# EAGLE design C-Track_V2_R1 (EAGLE 9.6.2)
ABTEILUNG: Technische Informatik; BEARBEITER: Samuel Putz; DOKUMENTART: Schaltplan; GEZ: PutS; ID: 5BHEL; REV: 1; STATUS: Prototyp; VER: 1.0
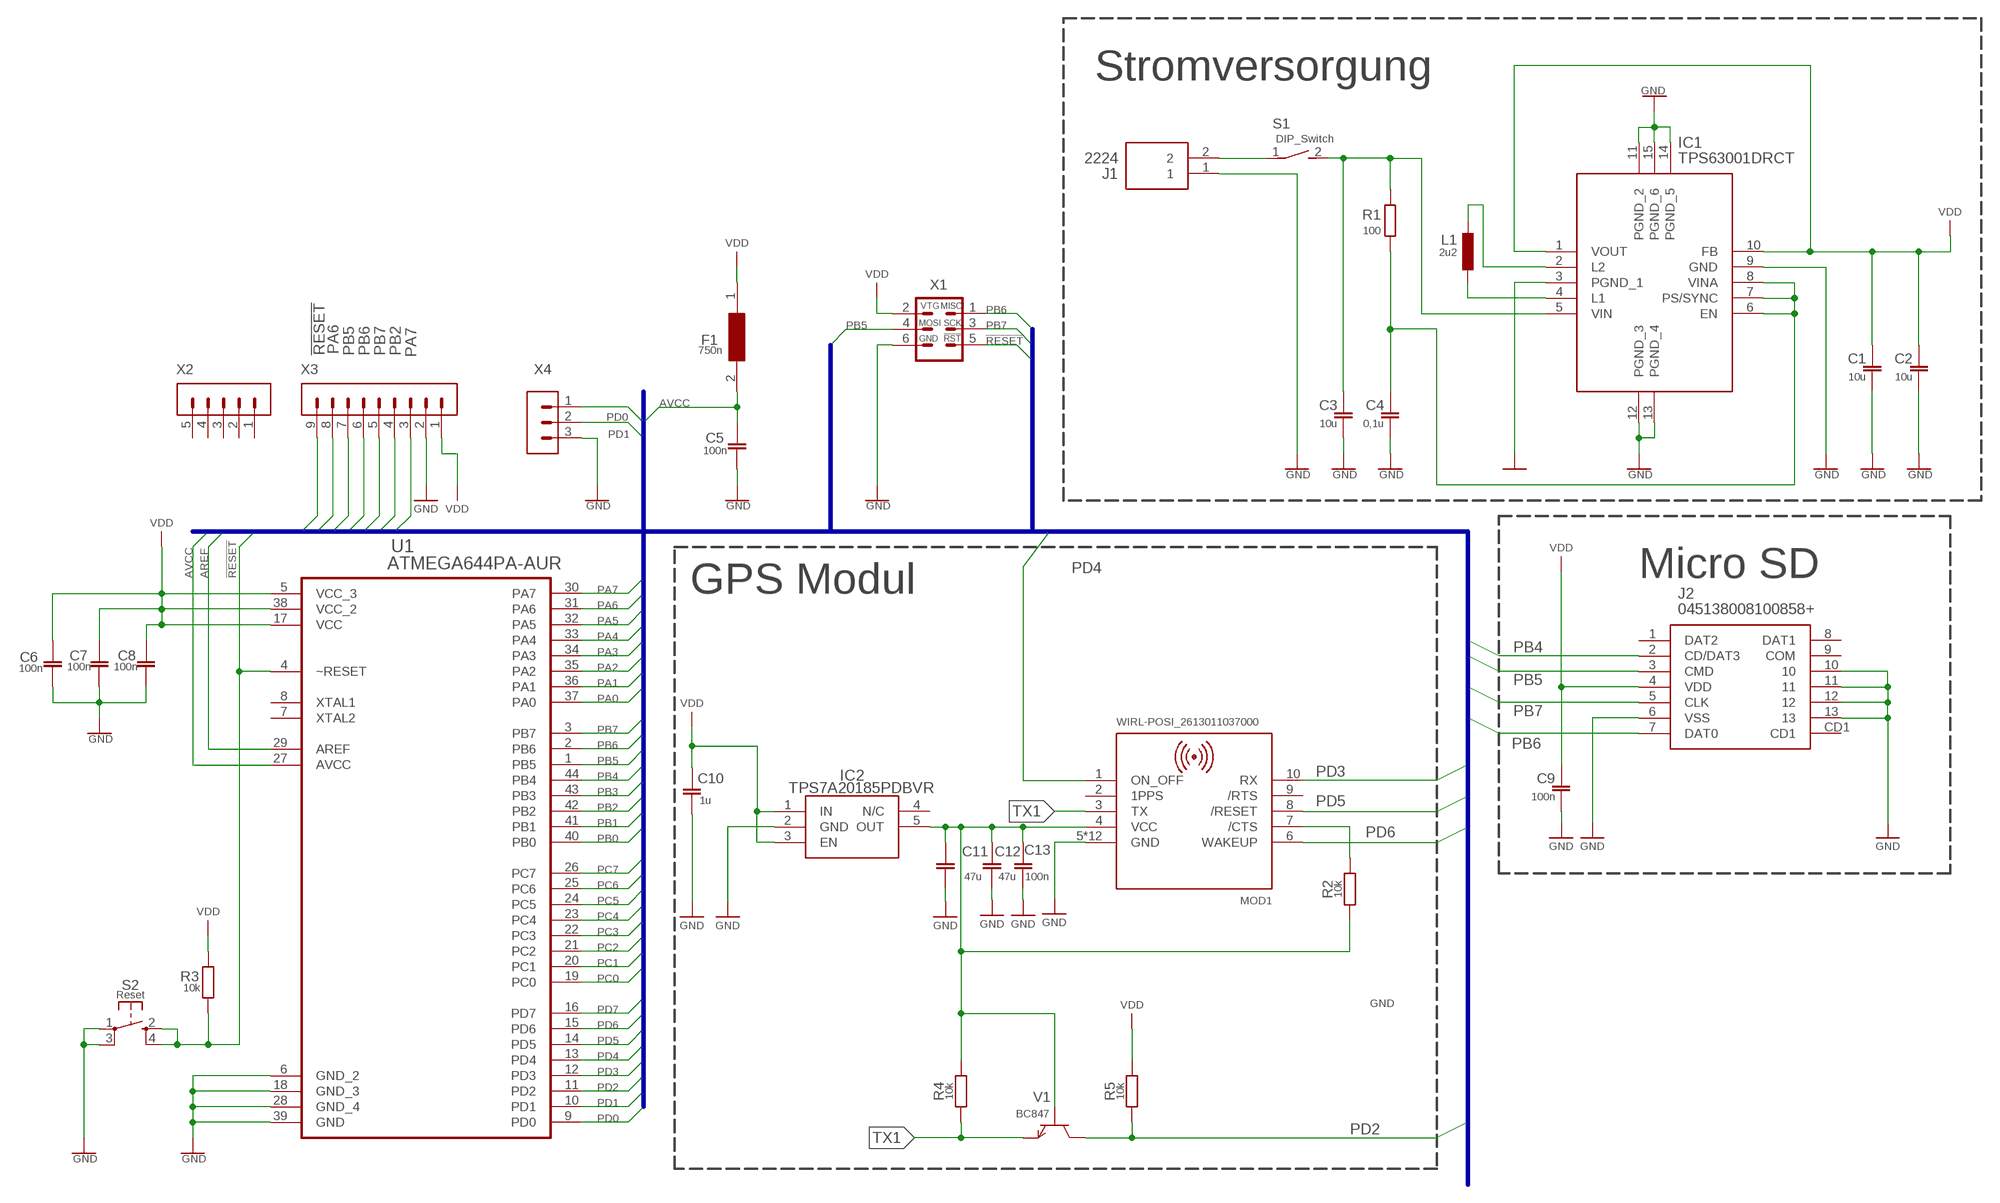
[diagram p0: schematic, sheet 1]

## Parts
C1  10u  C-EUC0805  [C0805]
C2  10u  C-EUC0805  [C0805]
C3  10u  C-EUC0805  [C0805]
C4  0,1u  C-EUC0805  [C0805]
C5  100n  C-EUC0805  [C0805]
C6  100n  C-EUC0805  [C0805]
C7  100n  C-EUC0805  [C0805]
C8  100n  C-EUC0805  [C0805]
C9  100n  C-EUC0805  [C0805]
C10  1u  C-EUC0805  [C0805]
C11  47u  C-EUC0805  [C0805]
C12  47u  C-EUC0805  [C0805]
C13  100n  C-EUC0805  [C0805]
F1  750n  SF-1206HH1200R-2  [SF1206HH1200R2]
IC1  TPS63001DRCT  [TPS63001DRCT]
IC2  TPS7A20185PDBVR  [SOT95P280X145-5N]
J1  2224  [2224]
J2  045138008100858+  [045138008100858]
L1  2u2  L-EU0805  [L0805]
MOD1  WIRL-POSI_2613011037000  [WIRL-POSI_2613011037000]
R1  100  R-EU_M0805  [M0805]
R2  10k  R-EU_M0805  [M0805]
R3  10k  R-EU_M0805  [M0805]
R4  10k  R-EU_M0805  [M0805]
R5  10k  R-EU_M0805  [M0805]
S1  DIP_Switch  DS04-254-2-01BK-SMT  [DS04254201BKSMT]
S2  Reset  TASTE10-XXWE_TASV_MICRO  [WS-TASV-MICRO]
U1  ATMEGA644PA-AUR  [QFP80P1200X1200X120-44N]
V1  BC847  [SOT23]
X1  MA03-2-  [MA03-2-]
X2  MA05-1  [MA05-1]
X3  MA09-1MA-09-1  [MA09-1]
X4  MA03-1  [MA03-1]

## Nets
!RESET: R3.1 S2.2(S) S2.4(S1) U1.4(~RESET) X1.5 X3.9
AREF: U1.29(AREF)
AVCC: C5.1 F1.2 U1.27(AVCC)
GND: C1.2 C2.2 C3.2 C4.2 C5.2 C6.2 C7.2 C8.2 C9.2 C10.2 C11.2 C12.2 C13.2 IC1.3(PGND_1) IC1.9(GND) IC1.11(PGND_2) IC1.12(PGND_3) IC1.13(PGND_4) IC1.14(PGND_5) IC1.15(PGND_6) IC2.2(GND) J1.1 J2.6(VSS) J2.10 J2.11 J2.12 J2.13 MOD1.5(GND) MOD1.P$1(GND) MOD1.P$2(GND) MOD1.P$3(GND) MOD1.P$4(GND) MOD1.P$5(GND) MOD1.P$6(GND) MOD1.P$7(GND) MOD1.P$8(GND) MOD1.P$9(GND) MOD1.P$10(GND) MOD1.P$11(GND) S2.1(P) S2.3(P1) U1.6(GND_2) U1.18(GND_3) U1.28(GND_4) U1.39(GND) X1.6 X3.2 X4.3
N$2: C3.1 IC1.5(VIN) R1.2 S1.2
N$3: IC1.4(L1) L1.1
N$4: C4.1 IC1.6(EN) IC1.7(PS/SYNC) IC1.8(VINA) R1.1
N$5: IC1.2(L2) L1.2
N$6: J1.2 S1.1
N$7: C11.1 C12.1 C13.1 IC2.5(OUT) MOD1.4(VCC) R2.1 R4.2 V1.1(B)
N$11: MOD1.7(/CTS) R2.2
PA0: U1.37(PA0)
PA1: U1.36(PA1)
PA2: U1.35(PA2)
PA3: U1.34(PA3)
PA4: U1.33(PA4)
PA5: U1.32(PA5)
PA6: U1.31(PA6) X3.8
PA7: U1.30(PA7) X3.3
PB0: U1.40(PB0)
PB1: U1.41(PB1)
PB2: U1.42(PB2) X3.4
PB3: U1.43(PB3)
PB4: J2.2(CD/DAT3) U1.44(PB4)
PB5: J2.3(CMD) U1.1(PB5) X1.4 X3.7
PB6: J2.7(DAT0) U1.2(PB6) X1.1 X3.6
PB7: J2.5(CLK) U1.3(PB7) X1.3 X3.5
PC0: U1.19(PC0)
PC1: U1.20(PC1)
PC2: U1.21(PC2)
PC3: U1.22(PC3)
PC4: U1.23(PC4)
PC5: U1.24(PC5)
PC6: U1.25(PC6)
PC7: U1.26(PC7)
PD0: U1.9(PD0) X4.1
PD1: U1.10(PD1) X4.2
PD2: R5.1 U1.11(PD2) V1.3(C)
PD3: MOD1.10(RX) U1.12(PD3)
PD4: MOD1.1(ON_OFF) U1.13(PD4)
PD5: MOD1.8(/RESET) U1.14(PD5)
PD6: MOD1.6(WAKEUP) U1.15(PD6)
PD7: U1.16(PD7)
TX1: MOD1.3(TX) R4.1 V1.2(E)
VDD: C1.1 C2.1 C6.1 C7.1 C8.1 C9.1 C10.1 F1.1 IC1.1(VOUT) IC1.10(FB) IC2.1(IN) IC2.3(EN) J2.4(VDD) R3.2 R5.2 U1.5(VCC_3) U1.17(VCC) U1.38(VCC_2) X1.2 X3.1
Unconnected: IC2.4(N/C) J2.1(DAT2) J2.8(DAT1) J2.9(COM) J2.CD1 MOD1.2(1PPS) MOD1.9(/RTS) U1.7(XTAL2) U1.8(XTAL1) X2.1 X2.2 X2.3 X2.4 X2.5

## Buses
AREF,AVCC,PA[0..7],PB[0..7],PC[0..7],PD[0..7],!RESET,VDD,XTAL2

## Notes on the sheet
- Stromversorgung
- VTG | MISO
- MOSI | SCK
- GND | !RST
- Micro SD
- GPS Modul

## Library data of the parts
C1-C13 = rcl_PutS:C-EU: CAPACITOR, European symbol
F1 = SF-1206HH1200R-2:SF-1206HH1200R-2: 1206 high-current met-foil. 12A Source: Datasheet <https://www.bourns.com/docs/Product-Datasheets/SF-1206HH-R.pdf>; DESCRIPTION: 1206 high-current met-foil. 12A; HEIGHT: 1.2mm; MANUFACTURER_NAME: Bourns; MANUFACTURER_PART_NUMBER: SF-1206HH1200R-2; MOUSER_PART_NUMBER: 652-SF-1206HH1200R-2; MOUSER_PRICE-STOCK: https://www.mouser.co.uk/ProductDetail/Bourns/SF-1206HH1200R-2?qs=Imq1NPwxi77cMrTLAtpSCg%3D%3D
IC1 = ic_PutS:TPS63001DRCT: Conv DC-DC Single-OUT Non-Inv/Step Source: Datasheet <https://www.ti.com/lit/gpn/TPS63001>; DESCRIPTION: Conv DC-DC Single-OUT Non-Inv/Step; HEIGHT: 1mm; MANUFACTURER_NAME: Texas Instruments; MANUFACTURER_PART_NUMBER: TPS63001DRCT; MOUSER_PART_NUMBER: 595-TPS63001DRCT; MOUSER_PRICE-STOCK: https://www.mouser.co.uk/ProductDetail/Texas-Instruments/TPS63001DRCT?qs=7kv20MEVUlgqNQNnGuTeFA%3D%3D
IC2 = SamacSys_Parts:TPS7A20185PDBVR: LDO Voltage Regulators 300-mA, ultra-low-noise, low-IQ, low-dropout (LDO) linear regulator with high PSRR 5-SOT-23 -40 to 125 Source: Datasheet <https://www.ti.com/lit/ds/symlink/tps7a20.pdf?ts=1627743306325&ref_url=https%3A%2F%2Fwww.ti.com%2Fproduct%2FTPS7A20>; DESCRIPTION: LDO Voltage Regulators 300-mA, ultra-low-noise, low-IQ, low-dropout (LDO) linear regulator with high PSRR 5-SOT-23 -40 to 125; HEIGHT: 1.45mm; MANUFACTURER_NAME: Texas Instruments; MANUFACTURER_PART_NUMBER: TPS7A20185PDBVR; MOUSER_PART_NUMBER: 595-TPS7A20185PDBVR; MOUSER_PRICE-STOCK: https://www.mouser.co.uk/ProductDetail/Texas-Instruments/TPS7A20185PDBVR?qs=hd1VzrDQEGgQiYm%252BUIe6ow%3D%3D
J1 = battery_PutS:2224: Cylindrical Battery Contacts, Clips, Holders & Springs C CELL ALUM HOLDER Source: Datasheet; DESCRIPTION: Cylindrical Battery Contacts, Clips, Holders & Springs C CELL ALUM HOLDER; HEIGHT: 20.32mm; MANUFACTURER_NAME: Keystone Electronics; MANUFACTURER_PART_NUMBER: 2224; MOUSER_PART_NUMBER: 534-2224; MOUSER_PRICE-STOCK: https://www.mouser.co.uk/ProductDetail/Keystone-Electronics/2224?qs=l8Mz4RVwyfn6c0GV6Hw2pQ%3D%3D
J2 = con_PutS:045138008100858+: Memory Card Connectors MICRO SD CARD 5138 SERIES Source: Datasheet <https://www.mouser.sg/datasheet/2/909/5138-1359342.pdf>; DESCRIPTION: Memory Card Connectors MICRO SD CARD 5138 SERIES; HEIGHT: 1.4mm; MANUFACTURER_NAME: AVX; MANUFACTURER_PART_NUMBER: 045138008100858+; MOUSER_PART_NUMBER: 581-045138008100858+; MOUSER_PRICE-STOCK: https://www.mouser.com/Search/Refine.aspx?Keyword=581-045138008100858%2B
L1 = rcl_PutS:L-EU: INDUCTOR, European symbol
MOD1 = WE_WIRL_Rev10:WIRL-POSI_2613011037000: Elara-I GNSS Module - GPS and GLONASS. WIRL-POSI GNSS Module - Integrated patch antenna Details see: https://we-online.de/katalog/en/article/2613011037000/; HEIGHT: 5.9mm; MANUFACTURER: Würth Elektronik; NR: 2613011037000
R1-R5 = rcl_PutS:R-EU_: RESISTOR, European symbol
S1 = switch_PutS:DS04-254-2-01BK-SMT: DIP Switches / SIP Switches DIP Switch, SPST, 2.54 pitch, flat actuator, SMT, 1 position, Black Source: Datasheet <https://datasheet.datasheetarchive.com/originals/distributors/Datasheets_SAMA/c6ff744c627a82ac82db8ce1595a468c.pdf>; DESCRIPTION: DIP Switches / SIP Switches DIP Switch, SPST, 2.54 pitch, flat actuator, SMT, 1 position, Black; HEIGHT: 4.85mm; MANUFACTURER_NAME: CUI Devices; MANUFACTURER_PART_NUMBER: DS04-254-2-01BK-SMT; MOUSER_PART_NUMBER: 490-DS04254201BK-SMT; MOUSER_PRICE-STOCK: https://www.mouser.co.uk/ProductDetail/CUI-Devices/DS04-254-2-01BK-SMT?qs=wnTfsH77Xs7VDGZ8jaePmA%3D%3D
S2 = switch_PoeR:TASTE10-XX: OMRON SWITCH
U1 = ic_PutS:ATMEGA644PA-AUR: 8-bit Microcontroller Microcontroller In-System Programmable Flash Check availability <https://pricing.snapeda.com/parts/ATMEGA644PA-AUR/Microchip/view-part?ref=eda>; AVAILABILITY: In Stock; CHECK_PRICES: https://www.snapeda.com/parts/ATMEGA644PA-AUR/Microchip/view-part/?ref=eda; DESCRIPTION: AVR AVR® ATmega Microcontroller IC 8-Bit 20MHz 64KB (32K x 16) FLASH 44-TQFP (10x10); MF: Microchip; MP: ATMEGA644PA-AUR; PACKAGE: TQFP-44 Atmel; PRICE: None; PURCHASE-URL: https://www.snapeda.com/api/url_track_click_mouser/?unipart_id=501858&manufacturer=Microchip&part_name=ATMEGA644PA-AUR&search_term=None; SNAPEDA_LINK: https://www.snapeda.com/parts/ATMEGA644PA-AUR/Microchip/view-part/?ref=snap
V1 = transistor_PoeF:BC84*: NPN Transistor SOT23-BEC, EN-60617 Mod. WenN / 2019 NPN Transistor: Marking of available current gain groups (Stempelung der lieferbaren Stromverstärkungsgruppen) BC846A = 1A BC846B = 1B BC847A = 1E BC847B = 1F BC847C = 1G BC850B = 1F BC850C = 1G BC848A = 1E BC848B = 1F BC848C = 1G BC849B = 1F BC849C = 1G
X1 = con_PoeR:MA03-2: PIN HEADER
X2 = con_PutS:MA05-1: PIN HEADER
X3 = con_PutS:MA09-1: PIN HEADER
X4 = con_PutS:MA03-1: PIN HEADER; OC_FARNELL: unknown; OC_NEWARK: unknown

## Board
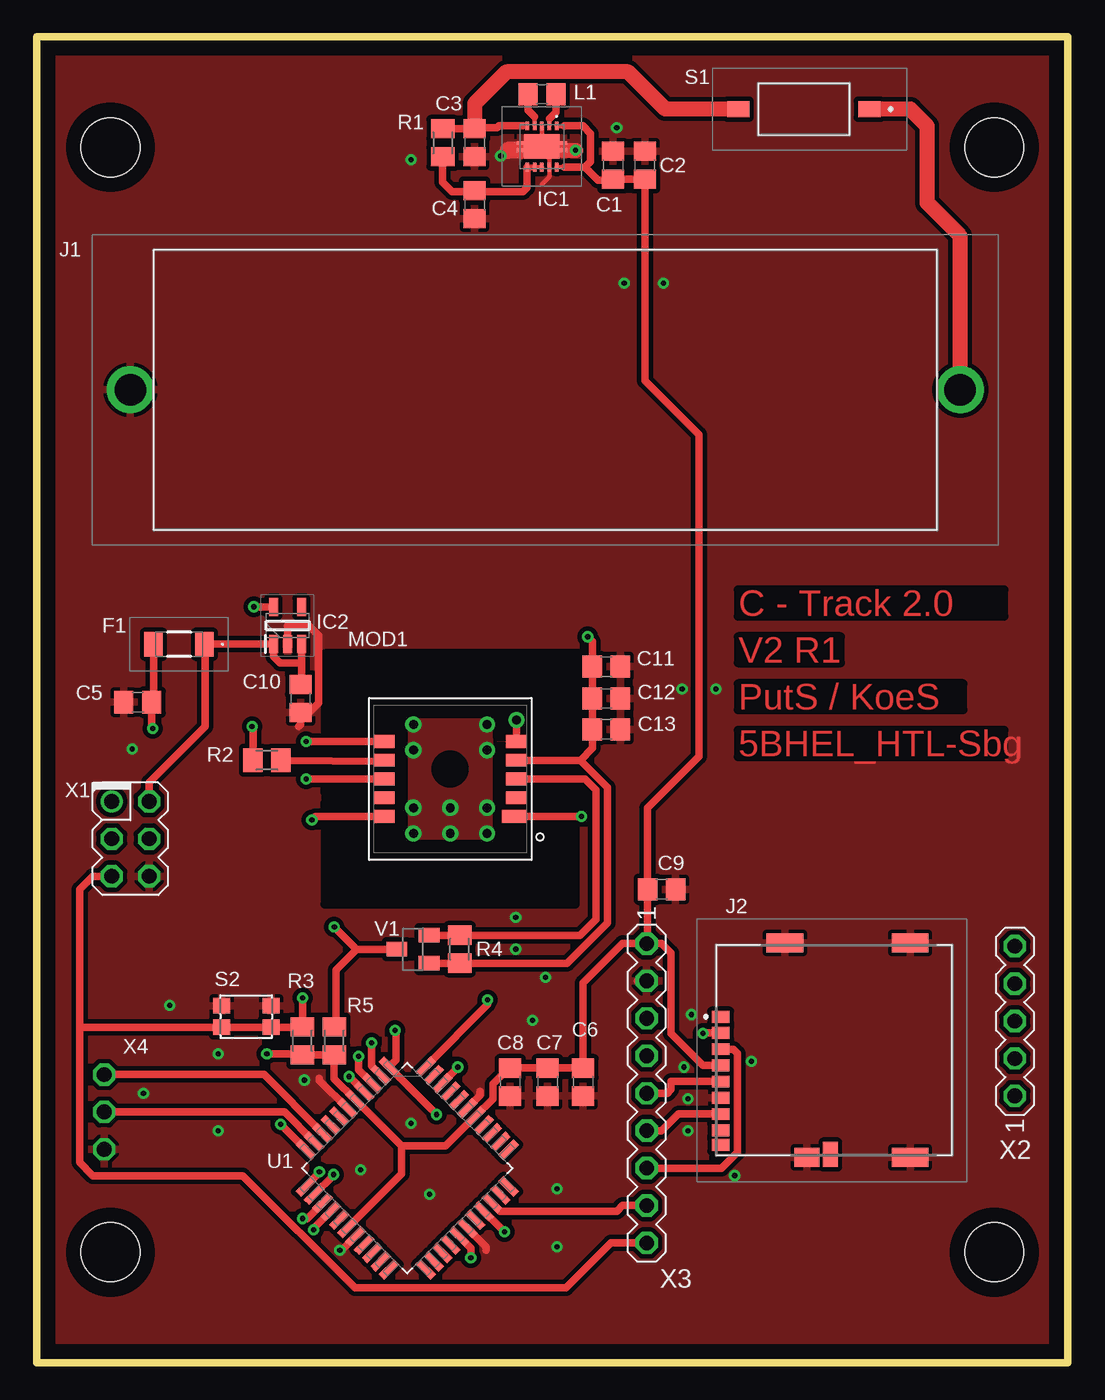
[diagram p1: board, top side]
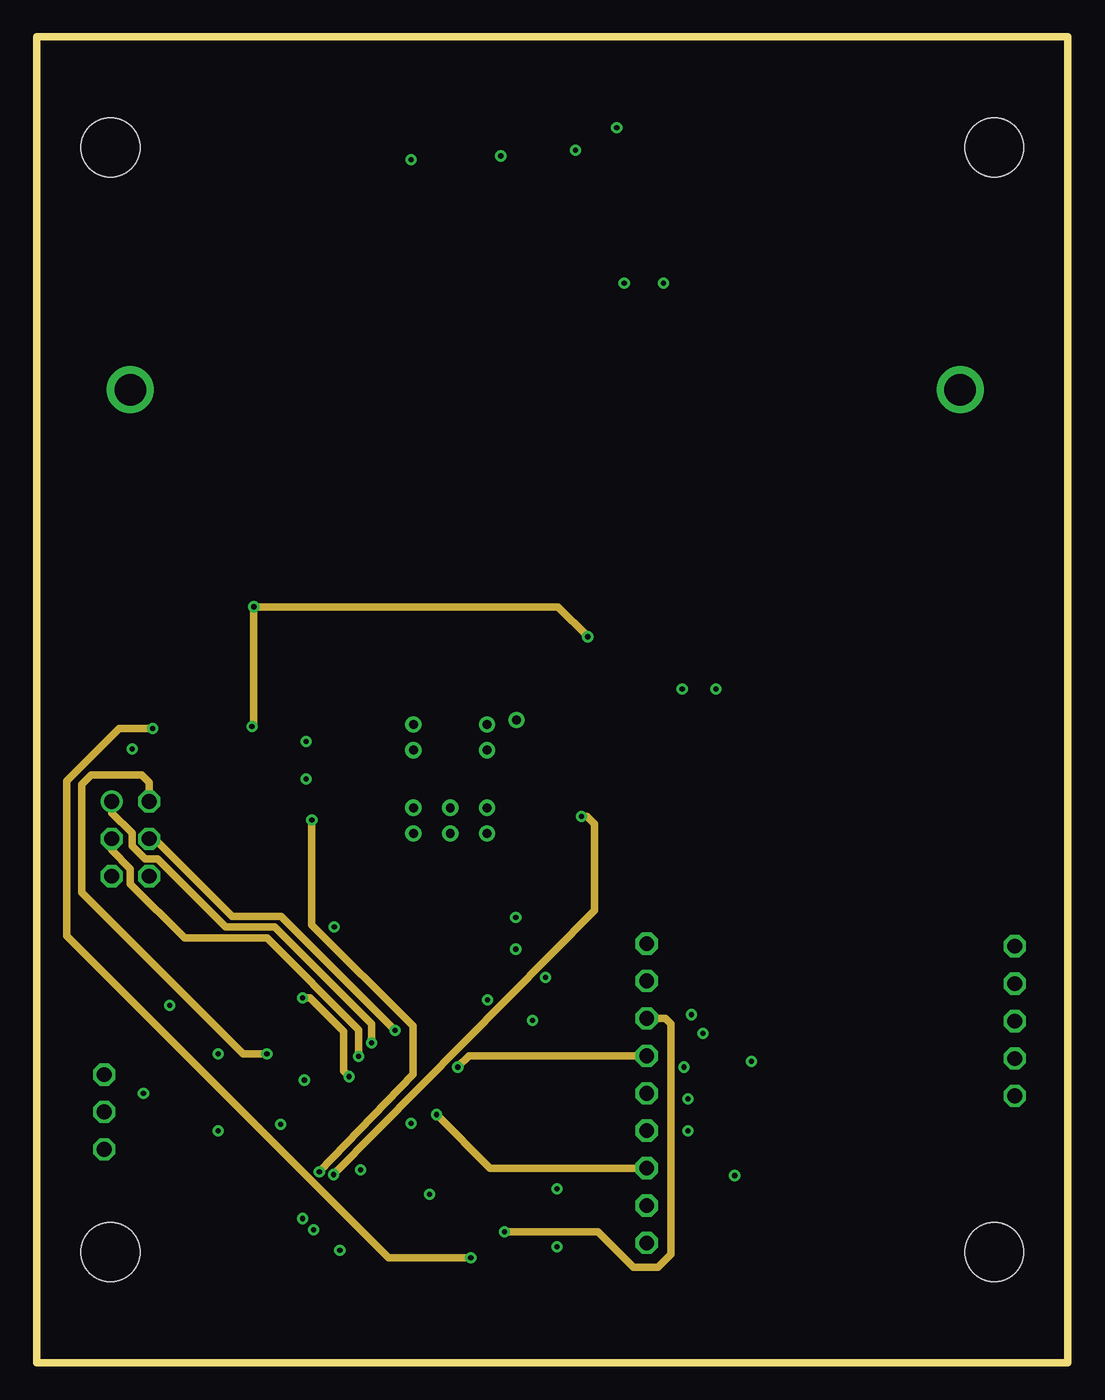
[diagram p2: board, inner layer Route2]
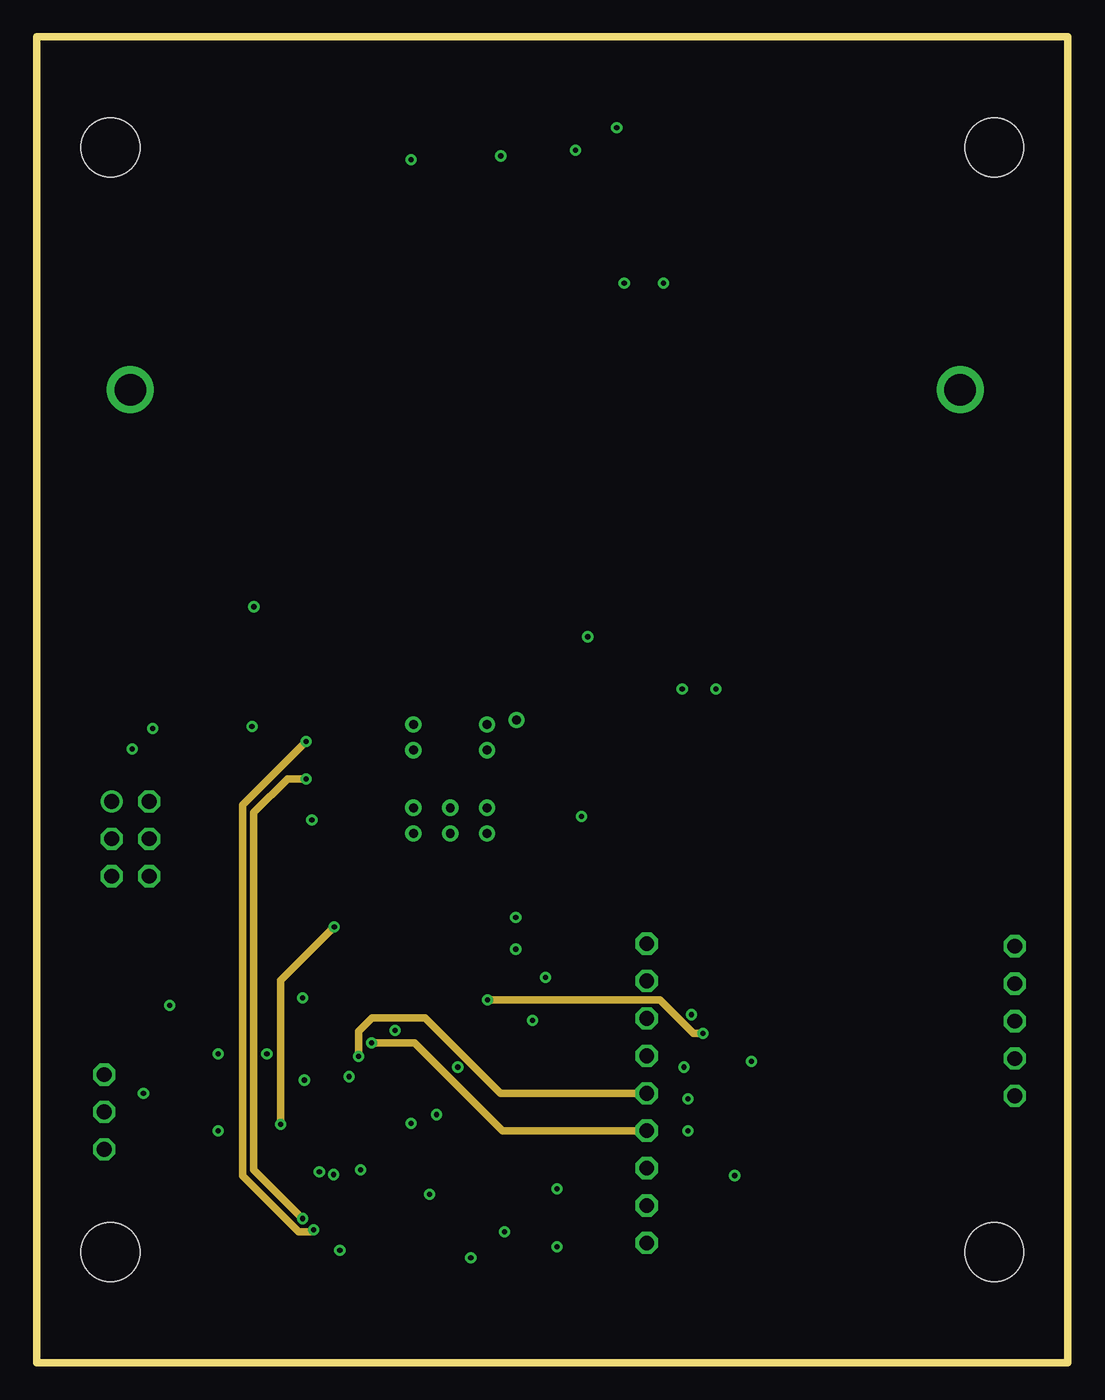
[diagram p3: board, inner layer Route15]
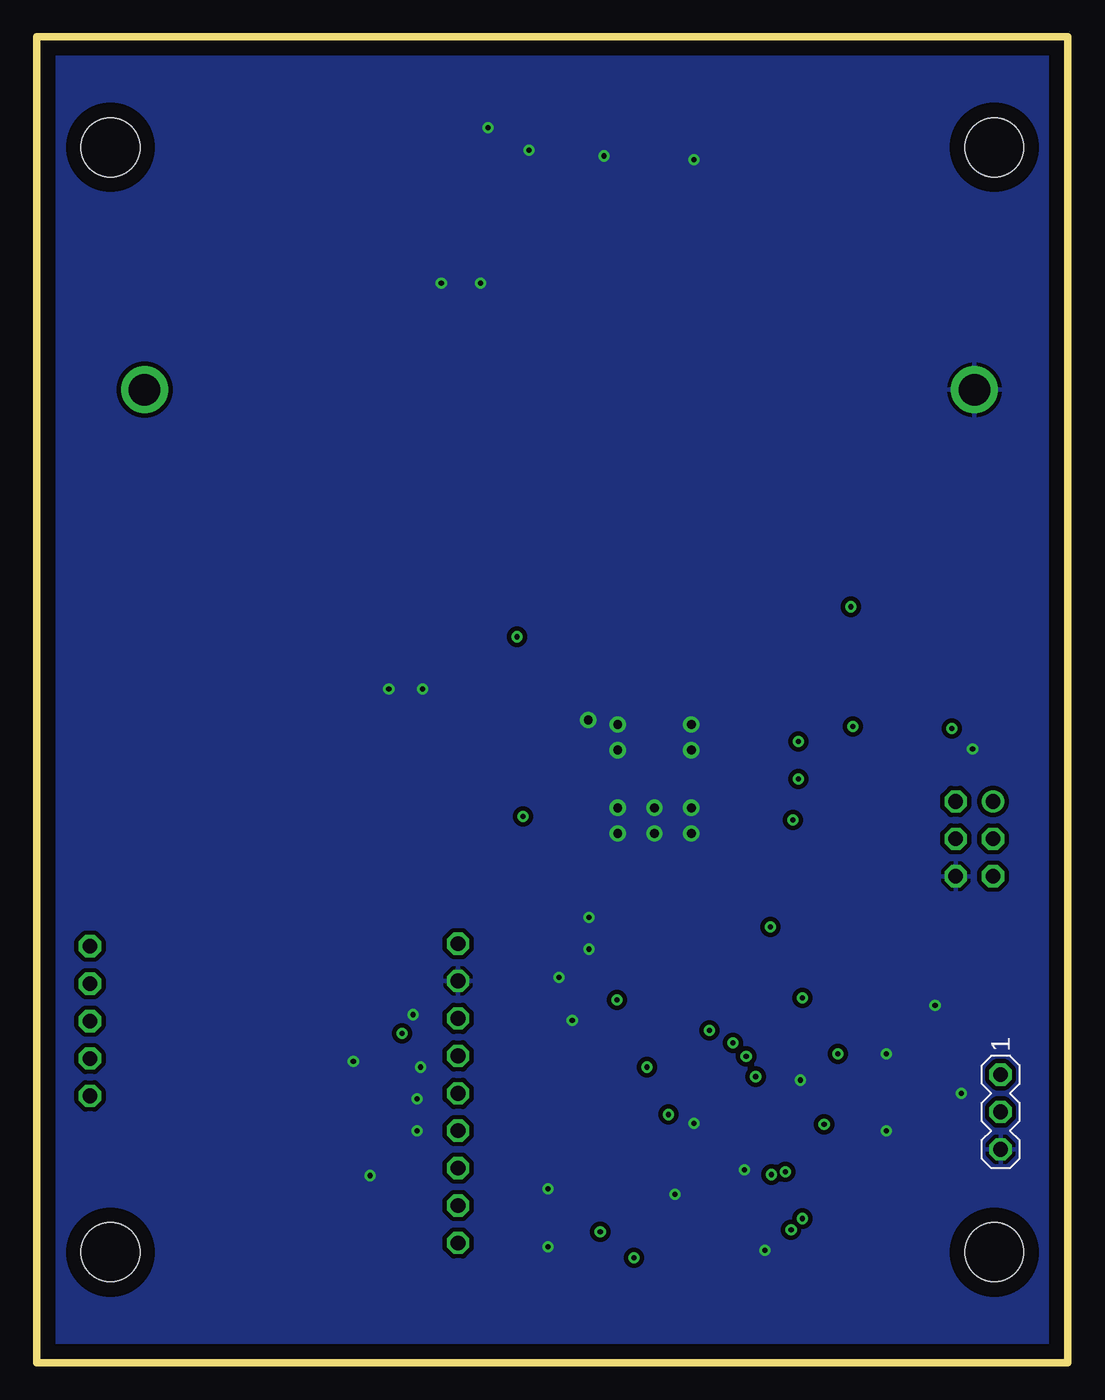
[diagram p4: board, bottom side, seen from below]

Size 70 x 90 mm. Coordinates in mm from the lower left corner, seen from the top.
Outline: 0,0 70,0 70,90 0,90 0,0
Copper layers (1+2*15+16): Top 0.035mm / dielectric 0.15mm / Route2 0.035mm / dielectric 0.15mm / Route15 0.035mm / dielectric 0.2mm / Bottom 0.035mm
Design rules "default *": minimum track width 6mil, minimum drill 0.35mm, track to track 6mil, track to pad 6mil, pad to pad 6mil, via to via 6mil, smd to smd 6mil, copper to edge 40mil, drill to drill 6mil, minimum pad ring 10mil, minimum via ring 8mil, stop-mask expansion 4mil, vias tented up to drill 0mil, thermal gap 10mil
Holes 4 mm at 5,82.5 65,82.5 65,7.5 5,7.5

### Footprints (pad centres in the part's own frame; a part is rotated, then mirrored left to right if it is on the bottom)
C0805 = smd 1.3 x 1.5: 1 -0.95,0; 2 0.95,0
SF1206HH1200R2 = smd 1.25 x 1.65: 1 -1.725,0; 2 1.725,0
TPS63001DRCT = smd 0.6 x 0.24: 1 -1.4,1; 2 -1.4,0.5; 3 -1.4,0; 4 -1.4,-0.5; 5 -1.4,-1; 6 1.4,-1; 7 1.4,-0.5; 8 1.4,0; 9 1.4,0.5; 10 1.4,1 | smd 1.65 x 2.4: 11 0,0 | smd 0.25 x 0.5: 12 -0.25,-1.45; 13 0.25,-1.45; 14 0.25,1.45; 15 -0.25,1.45
SOT95P280X145-5N = smd 1.2 x 0.6: 1 -1.25,0.95; 2 -1.25,0; 3 -1.25,-0.95; 4 1.25,-0.95; 5 1.25,0.95
2224 = drill 2.13 pad 3.195: 1 0,0; 2 56.34,0
045138008100858 = smd 0.8 x 1.2: 1 -2.27,-7.55; 2 -1.17,-7.55; 3 -0.07,-7.55; 4 1.03,-7.55; 5 2.13,-7.55; 6 3.23,-7.55; 7 4.33,-7.55; 8 5.43,-7.55; 9 6.43,-7.55 | smd 1.3 x 2.5: 10 -7.28,-3.19; 11 -7.28,5.31; 12 7.28,5.31 | smd 1.3 x 1.7: 13 7.28,-1.7 | smd 1.7 x 1: CD1 7.08,-0.1
L0805 = smd 1.3 x 1.5: 1 -0.95,0; 2 0.95,0
WIRL-POSI_2613011037000 = smd 1.676 x 0.864: 1 4.362,-2.54 | smd 1.422 x 0.864: 2 4.489,-1.27; 3 4.489,0; 4 4.489,1.27; 5 4.489,2.54; 6 -4.489,2.54; 7 -4.489,1.27; 8 -4.489,0; 9 -4.489,-1.27; 10 -4.489,-2.54 | drill 0.6: P$1 0,-3.7; P$2 -2.5,-3.7; P$3 2.5,-3.7; P$4 2.5,3.7; P$5 -2.5,3.7; P$6 -2.5,-1.96; P$7 -2.5,1.96; P$8 2.5,1.96; P$9 2.5,-1.96; P$10 0,-1.96; P$11 4.5,4
M0805 = smd 1.3 x 1.6: 1 -0.95,0; 2 0.95,0
DS04254201BKSMT = smd 1.1 x 1.5: 1 0,-4.45; 2 0,4.45
WS-TASV-MICRO = smd 1.15 x 1.05: 1 -1.675,0.725; 2 -1.675,-0.725; 3 1.675,0.725; 4 1.675,-0.725
QFP80P1200X1200X120-44N = smd 1.473 x 0.508: 1 -5.74,3.988; 2 -5.74,3.2; 3 -5.74,2.388; 4 -5.74,1.6; 5 -5.74,0.787; 6 -5.74,0; 7 -5.74,-0.787; 8 -5.74,-1.6; 9 -5.74,-2.388; 10 -5.74,-3.2; 11 -5.74,-3.988; 23 5.74,-3.988; 24 5.74,-3.2; 25 5.74,-2.388; 26 5.74,-1.6; 27 5.74,-0.787; 28 5.74,0; 29 5.74,0.787; 30 5.74,1.6; 31 5.74,2.388; 32 5.74,3.2; 33 5.74,3.988 | smd 0.508 x 1.473: 12 -3.988,-5.74; 13 -3.2,-5.74; 14 -2.388,-5.74; 15 -1.6,-5.74; 16 -0.787,-5.74; 17 0,-5.74; 18 0.787,-5.74; 19 1.6,-5.74; 20 2.388,-5.74; 21 3.2,-5.74; 22 3.988,-5.74; 34 3.988,5.74; 35 3.2,5.74; 36 2.388,5.74; 37 1.6,5.74; 38 0.787,5.74; 39 0,5.74; 40 -0.787,5.74; 41 -1.6,5.74; 42 -2.388,5.74; 43 -3.2,5.74; 44 -3.988,5.74
SOT23 = smd 1 x 1.4: 1 -0.95,-1.1; 2 0.95,-1.1; 3 0,1.1
MA03-2- = drill 1: 1 -2.54,-1.27 | drill 1 octagon: 2 -2.54,1.27; 3 0,-1.27; 4 0,1.27; 5 2.54,-1.27; 6 2.54,1.27
MA05-1 = drill 1 octagon: 1 -2.54,0; 2 0,0; 3 2.54,0; 4 5.08,0; 5 7.62,0
MA09-1 = drill 1 octagon: 1 -2.54,0; 2 0,0; 3 2.54,0; 4 5.08,0; 5 7.62,0; 6 10.16,0; 7 12.7,0; 8 15.24,0; 9 17.78,0
MA03-1 = drill 1 octagon: 1 -2.54,0; 2 0,0; 3 2.54,0

### Placement (x,y rotation side)
C1  39.12,81.28 90 top
C2  41.27,81.28 90 top
C3  29.72,82.8 270 top
C4  29.72,78.61 270 top
C5  6.86,44.83 180 top
C6  37.08,19.05 270 top
C7  34.67,19.05 270 top
C8  32.13,19.05 270 top
C9  42.42,32.13 0 top
C10  17.91,45.09 270 top
C11  38.66,47.24 0 top
C12  38.66,45.09 0 top
C13  38.66,42.99 0 top
F1  9.65,48.77 180 top
IC1  34.29,82.55 270 top
IC2  17.02,50.04 90 top
J1  6.35,66.04 0 top
J2  53.98,21.21 270 top
L1  34.29,86.11 0 top
MOD1  28.07,39.62 0 top
R1  27.56,82.8 90 top
R2  15.62,40.89 0 top
R3  18.03,21.84 270 top
R4  28.7,28.07 270 top
R5  20.19,21.84 270 top
S1  52.07,85.09 90 top
S2  14.22,23.5 0 top
U1  25.15,13.21 315 top
V1  25.53,28.07 90 top
X1  6.35,35.56 270 top
X2  66.4,20.65 90 top
X3  41.4,25.91 270 top
X4  4.57,17.02 270 bottom

### Tracks (layer width: path | path; a pad name or v marks a point on that pad's centre or on a via)
!RESET  (via drill 0.35)
  Top 0.152: v21.2,19.42
  Top 0.508: X1.5 3.81,33.02 2.92,32.13 2.92,22.77 | 2.92,22.77 2.92,13.59 3.81,12.7 13.97,12.7 21.59,5.08 35.94,5.08 38.99,8.13 X3.9 | U1.4 v21.2,19.42 | v18.03,24.77 R3.1 18.01,22.77 S2.4 S2.2 2.92,22.77
  Route2 0.508: v21.2,19.42 20.83,19.79 20.83,22.48 18.54,24.77 v18.03,24.77
AVCC  (via drill 0.35)
  Top 0.508: F1.2 7.93,44.95 C5.1 7.81,43.12 v7.87,43.05 | U1.27 29.46,7.78 v29.46,7.11
  Route2 0.508: v29.46,7.11 23.88,7.11 2.03,28.96 2.03,39.5 5.59,43.05 v7.87,43.05
GND  (via drill 0.35)
  Top 0.152: 35.81,82.23 IC1.14 | 32,82.3 31.75,82.55
  Top 0.305: IC1.3 IC1.11 | 34.79,82.05 IC1.9 34.79,80.51 34.29,80.01
  Top 0.508: IC1.14 35.49,82.55 IC1.11 | IC1.11 34.04,82.3 IC1.13 | IC1.11 34.79,82.05 | 30.48,37.66 MOD1.P$9 | MOD1.P$3 30.48,36.01 | 17.78,43.18 17.91,43.31 C10.2 18.49,44.13 19.14,44.78 19.14,49.35 18.49,50 17.02,50 IC2.2 17.02,50.04 17.14,50.16 | X3.2 40.77,25.91 | MOD1.5 32.57,42.17 MOD1.P$11 | v36.57,82.3 v36.58,82.3 | U1.28 30.48,7.87 30.48,7.62 | U1.39 30.1,18.16 30.1,18.41 | U1.6 19.18,19.18 19.18,19.3 | U1.18 21.64,8.56 20.7,7.62 v20.57,7.62
  Top 1.016: IC1.14 v36.57,82.3
  Top 1.143: IC1.13 32,82.3
  other vias: 39.37,83.82 18.16,19.18 26.67,11.43 21.97,13.08 25.4,16.26 12.32,20.95 9.02,24.26 25.4,81.66 31.5,81.92 7.24,18.29 6.48,41.66 44.45,23.62 43.94,20.07 48.51,20.45 47.37,12.7 44.2,15.75 43.81,45.72 46.1,45.72 33.66,23.24 35.31,11.81 35.31,7.87 32.51,30.23 32.51,28.07 34.54,26.16 44.2,17.91 12.32,15.75 39.88,73.28 42.55,73.28
  pour Top (isolate 0.305): 0,90 70,90 70,0 0,0
  pour Bottom (isolate 0.305): 0,90.17 69.85,90.17 69.85,0 0,0
N$2
  Top 0.305: 33.02,83.95 IC1.5
  Top 0.508: R1.2 C3.1 29.78,83.82 31.24,83.82 31.37,83.95 33.02,83.95
  Top 1.016: S1.2 42.67,85.09 40.13,87.63 31.88,87.63 29.72,85.47 C3.1
N$3
  Top 0.305: 33.34,85.09 33.34,85.02 | 33.79,84.57 IC1.4
  Top 0.508: L1.1 33.34,85.09 | 33.34,85.02 33.79,84.57
N$4
  Top 0.305: IC1.7 IC1.8
  Top 0.406: IC1.6 IC1.7
  Top 0.508: C4.1 29.78,79.5 | IC1.6 33.29,79.77 33.02,79.5 29.78,79.5 | R1.1 27.56,80.14 28.19,79.5 29.78,79.5
N$5
  Top 0.305: 34.79,84.45 IC1.2
  Top 0.508: L1.2 35.24,84.9 34.79,84.45
N$6
  Top 1.016: J1.2 62.69,76.5 60.45,78.74 60.45,83.95 59.31,85.09 S1.1
N$7  (via drill 0.35)
  Top 0.508: V1.1 R4.2 36.01,27.12 38.73,29.84 38.73,39.05 36.89,40.89 | v14.61,43.18 14.67,43.11 R2.1 | 36.89,40.89 37.71,41.71 C13.1 C12.1 C11.1 37.71,48.97 v37.4,49.28 | MOD1.4 36.89,40.89 | IC2.5 14.75,51.29 v14.73,51.31
  Route2 0.508: v14.61,43.18 14.73,43.31 v14.73,51.31 35.37,51.31 v37.4,49.28
N$11
  Top 0.508: R2.2 23.5,40.81 MOD1.7
PA6
  Top 0.508: X3.8 39.75,10.67 39.37,10.29 31.44,10.29 U1.31
PA7  (via drill 0.35)
  Top 0.508: U1.30 30.36,10.28 v31.75,8.89
  Route2 0.508: v31.75,8.89 38.1,8.89 40.51,6.48 42.16,6.48 43.05,7.37 43.05,22.98 42.67,23.37 X3.3
PB2  (via drill 0.35)
  Top 0.508: U1.42 28.57,20.01 v28.57,20.07
  Route2 0.508: v28.57,20.07 29.34,20.83 X3.4
PB4  (via drill 0.35)
  Top 0.508: U1.44 30.61,24.31 v30.61,24.64 | v45.21,22.35 45.24,22.38 J2.2
  Route15 0.508: v45.21,22.35 44.58,22.35 42.31,24.62 30.62,24.62 v30.61,24.64
PB5  (via drill 0.35)
  Top 0.508: v24.33,22.55 24.38,22.49 24.38,20.56 U1.1 27.13,16.86 v27.13,16.84 | X3.7 46.48,13.21 47.56,14.28 47.56,21 47.28,21.28 J2.3
  Route2 0.508: X1.4 8,35.56 13.27,30.29 16.59,30.29 v24.33,22.55 | v27.13,16.84 30.77,13.21 X3.7
PB6  (via drill 0.35)
  Top 0.508: U1.2 22.73,20.15 v22.73,21.72 | X3.6 42.42,15.75 43.55,16.88 J2.7
  Route2 0.508: X1.1 5.08,37.33 6.46,35.95 6.46,35.08 7.34,34.2 8.21,34.2 12.82,29.59 16.13,29.59 22.73,22.99 v22.73,21.72
  Route15 0.508: X3.6 31.62,15.75 25.65,21.72 v22.73,21.72
PB7  (via drill 0.35)
  Top 0.508: U1.3 21.84,19.89 v21.84,20.8 | J2.5 43.05,19.08 43.05,18.54 42.8,18.29 X3.5
  Route2 0.508: X1.3 5.08,34.8 6.35,33.53 6.35,32.51 10.03,28.83 15.62,28.83 21.84,22.61 v21.84,20.8
  Route15 0.508: X3.5 31.5,18.29 26.37,23.41 22.76,23.41 21.84,22.5 v21.84,20.8
PD0
  Top 0.508: X4.1 15.42,19.56 U1.9
PD1
  Top 0.508: X4.2 16.81,17.02 U1.10
PD2  (via drill 0.35)
  Top 0.508: R5.1 20.32,22.92 20.32,26.67 21.72,28.07 | 21.72,28.07 V1.3 | U1.11 v16.55,16.16 v16.55,16.17 | v20.19,29.59 21.72,28.07
  Route15 0.508: v16.55,16.17 16.55,25.95 v20.19,29.59
PD3  (via drill 0.35)
  Top 0.508: MOD1.10 18.92,37.08 v18.67,36.83 | U1.12 19.18,12.88 v19.18,12.95
  Route2 0.508: v19.18,12.95 25.53,19.58 25.53,22.86 18.67,29.72 v18.67,36.83
PD4  (via drill 0.35)
  Top 0.508: MOD1.1 v36.98,37.08 | U1.13 20.14,12.72 v20.14,12.77
  Route2 0.508: v36.98,37.08 37.34,37.08 37.85,36.58 37.85,30.71 v20.14,12.77
PD5  (via drill 0.35)
  Top 0.508: U1.14 18.34,9.78 v18.03,9.78 | v18.29,39.62 MOD1.8
  Route15 0.508: v18.03,9.78 14.73,13.08 14.73,37.34 17.02,39.62 v18.29,39.62
PD6  (via drill 0.35)
  Top 0.508: U1.15 18.8,9.12 v18.8,9.02 | v18.29,42.16 MOD1.6
  Route15 0.508: v18.8,9.02 18.67,8.89 17.78,8.89 13.97,12.7 13.97,37.85 v18.29,42.16
TX1
  Top 0.508: V1.2 R4.1 36.89,29.02 37.97,30.1 37.97,38.86 37.21,39.62 MOD1.3
VDD  (via drill 0.35)
  Top 0.305: 35.81,83.95 IC1.1 | 35.81,81.15 IC1.10
  Top 0.508: 37.21,81.15 38.1,80.26 39.05,80.26 C1.1 C2.1 41.27,66.67 44.96,62.99 44.96,41.15 41.47,37.66 C9.1 41.47,28.52 X3.1 | F1.1 11.43,48.77 | 11.43,48.77 16.05,48.77 IC2.1 16.07,47.94 16.51,47.5 17.97,47.5 | IC2.3 17.97,47.5 | 17.97,47.5 17.97,46.1 C10.1 | X1.2 7.62,39.37 11.43,43.18 11.43,48.77 | v15.62,20.95 17.97,20.95 R3.2 R5.2 20.19,19.27 U1.5 24.77,14.7 | 37.21,81.15 37.59,81.53 37.59,83.44 37.08,83.95 35.82,83.95 35.81,83.95 | X3.1 39.75,28.45 37.08,25.79 C6.1 C7.1 C8.1 32.06,20 30.98,18.92 30.98,17.92 U1.38 27.75,14.7 24.77,14.7 | U1.17 24.77,12.83 24.77,14.7 | 37.21,81.15 35.81,81.15 | J2.4 45.23,20.18 43.05,22.35 43.05,27.81 42.42,28.45 X3.1
  Route2 0.508: X1.2 7.62,39.37 7.11,39.88 3.68,39.88 3.05,39.24 3.05,31.93 14.02,20.95 v15.62,20.95

### Text on the board
Top: C - Track 2.0 | V2 R1 | PutS / KoeS | 5BHEL_HTL-Sbg